# Altium schematic sheet I2C_Peripherals.SchDoc
size A4
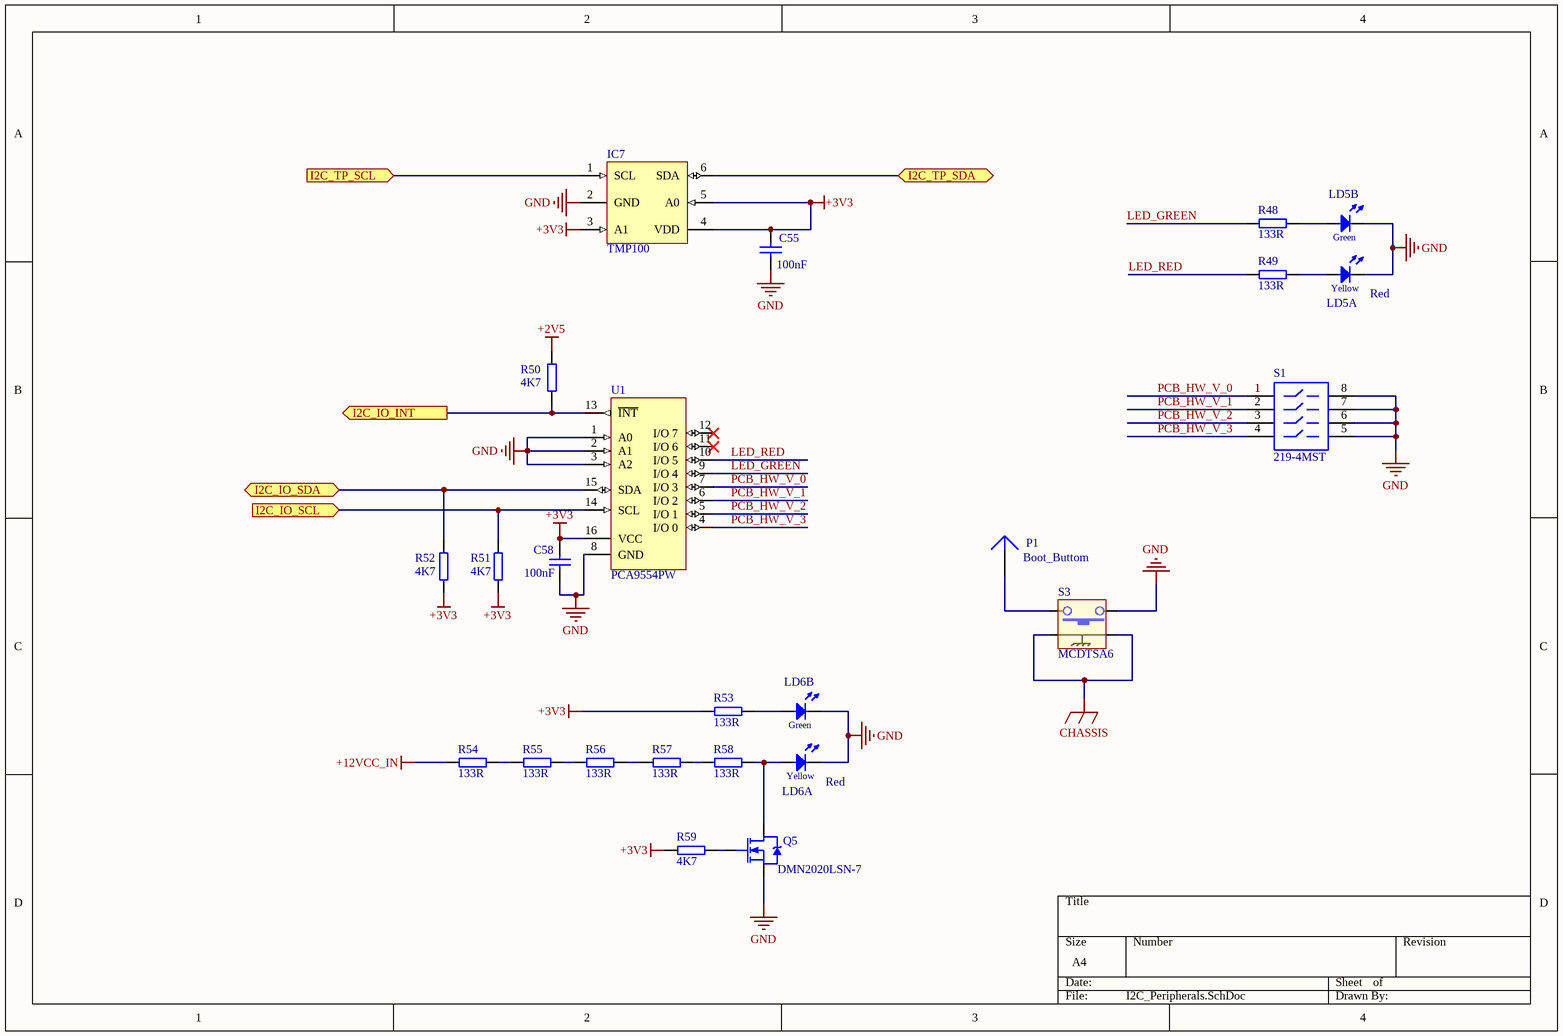
[diagram p0: I2C_Peripherals.SchDoc]

## Parts
C55  100nF  [CC1608-0603]
C58  100nF  [CC1608-0603]
IC7  TMP100  [SOT23A-6L]
LD5  Red  [LED_DIALIGHT_591-3x0x-0xx]  (parts A,B of 2)
LD6  Red  [LED_DIALIGHT_591-3x0x-0xx]  (parts A,B of 2)
P1  Boot_Buttom  [PIN1-RT-01T-1.0B(LF)]
Q5  DMN2020LSN-7  [SC-59-3]
R48  133R  [0603]
R49  133R  [0603]
R50  4K7  [0603]
R51  4K7  [0603]
R52  4K7  [0603]
R53  133R  [0603]
R54  133R  [0603]
R55  133R  [0603]
R56  133R  [0603]
R57  133R  [0603]
R58  133R  [0603]
R59  4K7  [0603]
S1  219-4MST  [NHDS-8]
S3  MCDTSA6  [MCDTSA6]
U1  PCA9554PW  [SOP65P640X120-16N]

## Ports
I2C_IO_INT (out), I2C_IO_SCL (in), I2C_IO_SDA (bidir), I2C_TP_SCL (in), I2C_TP_SDA (bidir)

## Nets
+2V5: R50.2
+3V3: C55.2 C58.1 IC7.3(A1) IC7.4(VDD) IC7.5(A0) R51.2 R52.2 R53.1 R59.2 U1.16(VCC)
+12VCC_IN: R54.1
CHASSIS: S3.3 S3.4
GND: C55.1 C58.2 IC7.2(GND) LD5.1(C) LD5.4(C) LD6.1(C) LD6.4(C) Q5.3(S) S1.5 S1.6 S1.7 S1.8 S3.1 U1.1(A0) U1.2(A1) U1.3(A2) U1.8(GND)
I2C_IO_INT: R50.1 U1.13(~{INT}) ; port I2C_IO_INT
I2C_IO_SCL: R51.1 U1.14(SCL) ; port I2C_IO_SCL
I2C_IO_SDA: R52.1 U1.15(SDA) ; port I2C_IO_SDA
I2C_TP_SCL: IC7.1(SCL) ; port I2C_TP_SCL
I2C_TP_SDA: IC7.6(SDA) ; port I2C_TP_SDA
LED_GREEN: R48.1 U1.9(I/O_4)
LED_RED: R49.1 U1.10(I/O_5)
PCB_HW_V_0: S1.1 U1.7(I/O_3)
PCB_HW_V_1: S1.2 U1.6(I/O_2)
PCB_HW_V_2: S1.3 U1.5(I/O_1)
PCB_HW_V_3: S1.4 U1.4(I/O_0)
NetLD5_2: LD5.2(A) R49.2
NetLD5_3: LD5.3(A) R48.2
NetLD6_2: LD6.2(A) Q5.2(D) R58.2
NetLD6_3: LD6.3(A) R53.2
NetP1_1: P1.1 S3.2
NetQ5_1: Q5.1(G) R59.1
NetR54_2: R54.2 R55.1
NetR55_2: R55.2 R56.1
NetR56_2: R56.2 R57.1
NetR57_2: R57.2 R58.1

Not connected (* = marked no-connect by the designer): U1 11(I/O_6)* 12(I/O_7)*

## Notes on the sheet
- (in symbol LED_DIALIGHT_591-3x0x, part A) Yellow

## Library data of the parts
C55 C58 = CC0603_100NF_16V_10%_X7R: Capacitor; Manufacturer1: AVX; Manufacturer1 PN: 0603YC104KAT2A; TC: X7R; Tolerance: ±10%; Voltage: 16V; Published: 8-Jun-2000; LatestRevisionDate: 17-Jul-2002; LatestRevisionNote: Re-released for DXP Platform.; PackageReference: RAD-0.3; Publisher: Altium Limited; Distributor1: Digikey; Distributor1 PN: 478-1239-1-ND; Case: 0603; Value: 100nF
IC7 = TMP100: I2C temp. sensor; RefId: 296-12750-1-ND; Value: TMP101NA/250; Supplier: Digikey
LD5 LD6 = LED_DIALIGHT_591-3x0x: Bi-Color LED SMD; Manufacturer1 PN: 591-3001-013F; Color: Red; Footprint: LED_DIALIGHT_571-0132F; Manufacturer1: DIALIGHT; ComponentHeight: 5mm; Distributor1: Mouser; Distributor1 PN: 645-591-3001-013F
P1 = Plug: Manufacturer1 PN: RT-01T-1.0B(LF); Manufacturer1: JST; LatestRevisionDate: 17-Jul-2002; LatestRevisionNote: Re-released for DXP Platform.; Publisher: Altium Limited; Distributor1: Farnell; Distributor1 PN: 9492208
Q5 = DMN2020LSN-7: N-Channel Power MOSFET; Manufacturer: Diodes Inc.; Published: 8-Jun-2000; LatestRevisionDate: 17-Jul-2002; LatestRevisionNote: Re-released for DXP Platform.; DatasheetVersion: PD-9.814; Publisher: Altium Limited; ComponentLink1Description: Manufacturer Link; ComponentLink1URL: http://www.irf.com/; Value: DMN2020LSN-7; Distributor1: Digikey; Distributor1 PN: DMN2020LSN-7DICT-ND
R48 R49 R53-R58 = R0603_133R_±1%_0.1W_100PPM: SMD Resistor; Manufacturer1: Yageo; Manufacturer1 PN: 311-133HRCT-ND; TCR: 100ppm; Power Rating: 0.1W; Tolerance: ±1%; Case: 0603; Distributor1: DigiKey; Distributor1 PN: RC0603FR-07133RL; Value: 133R
R50-R52 R59 = R0603_4.7K_±1%_0.1W_100PPM: SMD Resistor; Manufacturer1: Panasonic; Manufacturer1 PN: ERJ-3EKF4701V; TCR: 100ppm; Power Rating: 0.1W; Tolerance: ±1%; Case: 0603; Distributor1: DigiKey; Distributor1 PN: P4.70KHCT-ND; Value: 4K7
S1 = SW-DIP4: 4 Positions DIP SWITCH; Manufacturer1: CTS Electrocomponents; Distributor1 PN: CT2194MST-ND; Distributor1: Digikey; Manufacturer1 PN: 219-4MST
S3 = MCDTSA6: Push button SPNO Right Angle Through Hole; Manufacturer1 PN: MCDTSA6-5K; Manufacturer1: Multicomp; Distributor1: Farnell; Distributor1 PN: 9471790
U1 = PCA9554D: 8-bit I2C-bus SMBus I/O port with interrupt; Manufacturer1 PN: PCA9554PW,112; Manufacturer1: NXP Semiconductors; Distributor1: Digikey; Distributor1 PN: 568-3984-5-ND